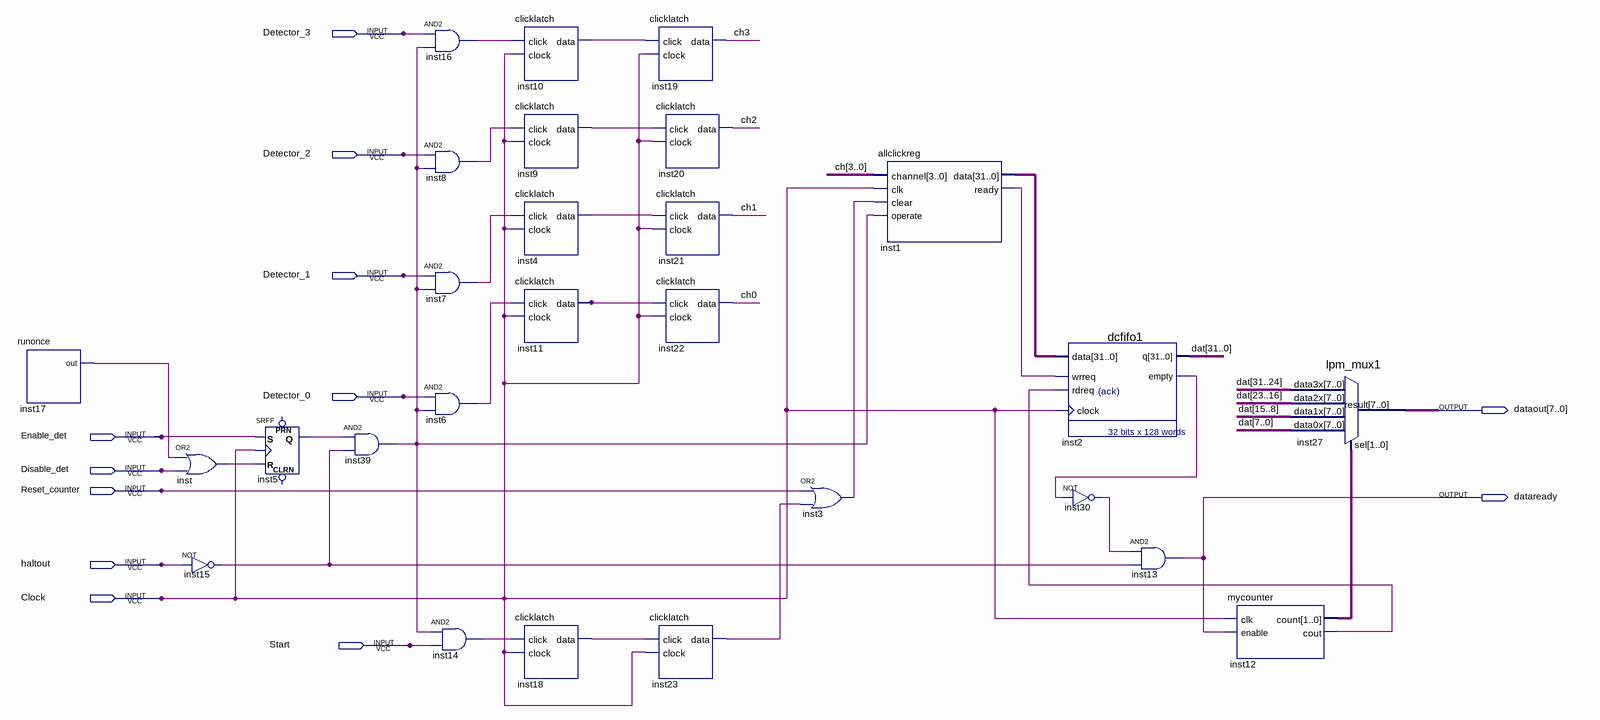
[diagram p0: schematic sheet]
// Quartus schematic apdtimer_all.bdf as structural Verilog: 27 symbols, 12 pins
module apdtimer_all (
  input  Detector_3,
  input  Detector_2,
  input  Detector_1,
  input  Detector_0,
  input  Enable_det,
  input  Disable_det,
  input  Reset_counter,
  input  haltout,
  input  Clock,
  input  Start,
  output [7:0] dataout,
  output dataready
);

  wire inst1_ready, inst2_empty, inst3_out, inst4_data, inst5_q, inst6_out, inst7_out, inst8_out, inst9_data,
       inst10_data, inst11_data, inst12_cout, inst14_out, inst15_out, inst16_out, inst17_out, inst18_data,
       inst23_data, inst30_out, inst39_out, inst_out;
  wire [1:0] inst12_count;
  wire [3:0] ch;
  wire [31:0] dat, inst1_data;

  runonce inst17 (.out(inst17_out));
  or inst (inst_out, inst17_out, Disable_det);
  not inst15 (inst15_out, haltout);
  SRFF inst5 (.S(Enable_det), .R(inst_out), .CLK(Clock), .Q(inst5_q));  // open: PRN, CLRN
  and inst39 (inst39_out, inst5_q, inst15_out);
  and inst16 (inst16_out, Detector_3, inst39_out);
  and inst8 (inst8_out, Detector_2, inst39_out);
  and inst7 (inst7_out, Detector_1, inst39_out);
  and inst6 (inst6_out, Detector_0, inst39_out);
  and inst14 (inst14_out, inst39_out, Start);
  clicklatch inst10 (.click(inst16_out), .clock(Clock), .data(inst10_data));
  clicklatch inst9 (.click(inst8_out), .clock(Clock), .data(inst9_data));
  clicklatch inst4 (.click(inst7_out), .clock(Clock), .data(inst4_data));
  clicklatch inst11 (.click(inst6_out), .clock(Clock), .data(inst11_data));
  clicklatch inst18 (.click(inst14_out), .clock(Clock), .data(inst18_data));
  clicklatch inst19 (.click(inst10_data), .clock(Clock), .data(ch[3]));
  clicklatch inst20 (.click(inst9_data), .clock(Clock), .data(ch[2]));
  clicklatch inst21 (.click(inst4_data), .clock(Clock), .data(ch[1]));
  clicklatch inst22 (.click(inst11_data), .clock(Clock), .data(ch[0]));
  clicklatch inst23 (.click(inst18_data), .clock(Clock), .data(inst23_data));
  or inst3 (inst3_out, Reset_counter, inst23_data);
  allclickreg inst1 (
    .channel(ch), .clk(Clock), .clear(inst3_out), .operate(inst39_out), .data(inst1_data), .ready(inst1_ready));
  dcfifo1 inst2 (
    .data(inst1_data), .wrreq(inst1_ready), .rdreq(inst12_cout), .clock(Clock), .q(dat), .empty(inst2_empty));
  not inst30 (inst30_out, inst2_empty);
  and inst13 (dataready, inst30_out, inst15_out);
  mycounter inst12 (.clk(Clock), .enable(dataready), .count(inst12_count), .cout(inst12_cout));
  lpm_mux1 inst27 (
    .data3x(dat[31:24]), .data2x(dat[23:16]), .data1x(dat[15:8]), .data0x(dat[7:0]), .sel(inst12_count),
    .result(dataout));
endmodule
